# Altium schematic sheet [00] Block Diagram.SchDoc
size A4
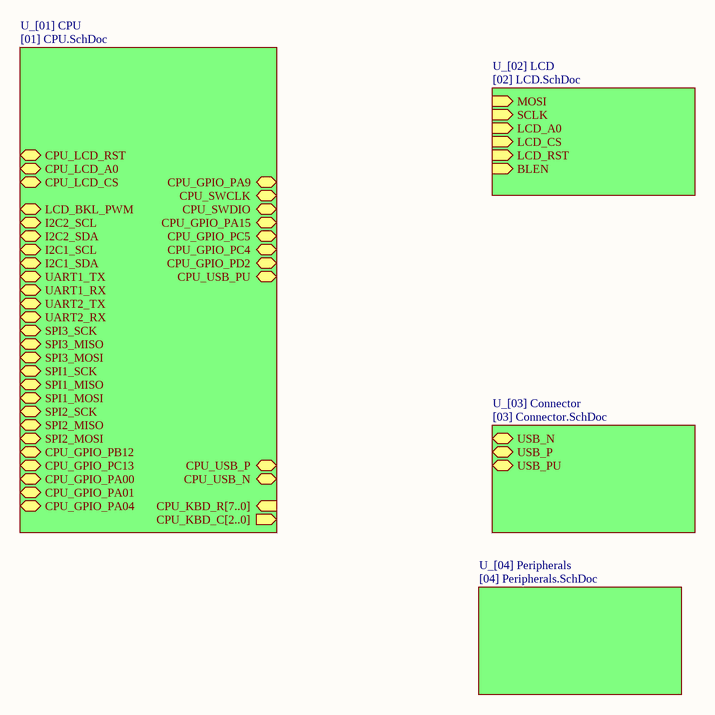
[diagram p0: [00] Block Diagram.SchDoc]

## Sub-sheets
U_[01] CPU = [01] CPU.SchDoc: CPU_KBD_R[7..0] (in), CPU_KBD_C[2..0] (out), CPU_USB_P (bidir), CPU_USB_N (bidir), CPU_LCD_RST (bidir), CPU_LCD_A0 (bidir), CPU_LCD_CS (bidir), LCD_BKL_PWM (bidir), I2C2_SCL (bidir), I2C2_SDA (bidir), I2C1_SCL (bidir), I2C1_SDA (bidir), UART1_TX (bidir), UART1_RX (bidir), UART2_TX (bidir), UART2_RX (bidir), SPI3_SCK (bidir), SPI3_MISO (bidir), SPI3_MOSI (bidir), SPI1_SCK (bidir), SPI1_MISO (bidir), SPI1_MOSI (bidir), SPI2_SCK (bidir), SPI2_MISO (bidir), SPI2_MOSI (bidir), CPU_GPIO_PB12 (bidir), CPU_GPIO_PC13 (bidir), CPU_GPIO_PA00 (bidir), CPU_GPIO_PA01 (bidir), CPU_GPIO_PA04 (bidir), CPU_GPIO_PA9 (bidir), CPU_SWCLK (bidir), CPU_SWDIO (bidir), CPU_GPIO_PA15 (bidir), CPU_GPIO_PC5 (bidir), CPU_GPIO_PC4 (bidir), CPU_GPIO_PD2 (bidir), CPU_USB_PU (bidir)
U_[02] LCD = [02] LCD.SchDoc: MOSI (in), SCLK (in), LCD_A0 (in), LCD_CS (in), LCD_RST (in), BLEN (in)
U_[03] Connector = [03] Connector.SchDoc: USB_N (bidir), USB_P (bidir), USB_PU (bidir)
U_[04] Peripherals = [04] Peripherals.SchDoc: no entries